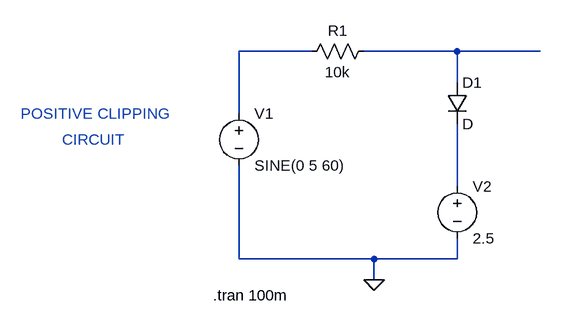
[diagram p0: schematic Positive clipping circuit.asc]
Positive clipping circuit.asc, the LTspice schematic file:
Version 4
SHEET 1 880 680
WIRE 192 32 80 32
WIRE 416 32 272 32
WIRE 544 32 416 32
WIRE 416 80 416 32
WIRE 80 128 80 32
WIRE 416 240 416 144
WIRE 80 352 80 208
WIRE 288 352 80 352
WIRE 416 352 416 320
WIRE 416 352 288 352
WIRE 288 384 288 352
FLAG 288 384 0
SYMBOL voltage 80 112 R0
WINDOW 123 0 0 Left 0
WINDOW 39 0 0 Left 0
SYMATTR InstName V1
SYMATTR Value SINE(0 5 60)
SYMBOL voltage 416 224 R0
WINDOW 123 0 0 Left 0
WINDOW 39 0 0 Left 0
SYMATTR InstName V2
SYMATTR Value 2.5
SYMBOL res 288 16 R90
WINDOW 0 0 56 VBottom 2
WINDOW 3 32 56 VTop 2
SYMATTR InstName R1
SYMATTR Value 10k
SYMBOL diode 400 80 R0
SYMATTR InstName D1
TEXT 40 408 Left 2 !.tran 100m
TEXT -256 128 Left 2 ;POSITIVE CLIPPING
TEXT -192 168 Left 2 ;CIRCUIT

The netlist it stands for:
* Positive clipping circuit.asc
V1 N001 0 SINE(0 5 60)
V2 N003 0 2.5
R1 N002 N001 10k
D1 N002 N003 D
.model D D
.lib standard.dio
.tran 100m
* POSITIVE CLIPPING
* CIRCUIT
.backanno
.end